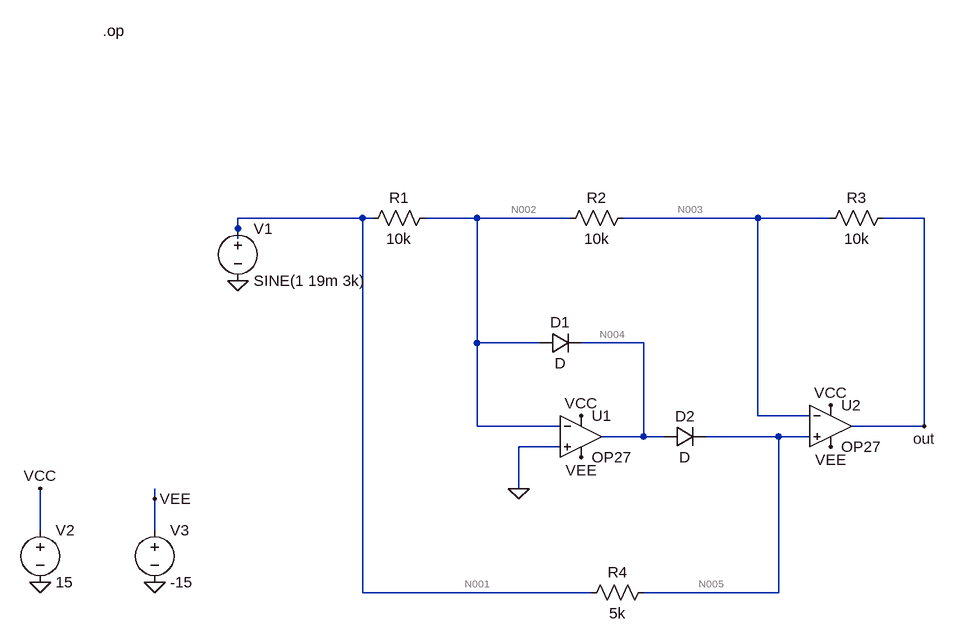
[diagram p0: schematic fullwaverect-DCOP.asc]
fullwaverect-DCOP.asc, the LTspice schematic file:
Version 4.1
SHEET 1 880 680
WIRE -128 -64 -320 -64
WIRE -112 -64 -128 -64
WIRE 48 -64 -32 -64
WIRE 192 -64 48 -64
WIRE 480 -64 272 -64
WIRE 592 -64 480 -64
WIRE 736 -64 672 -64
WIRE -320 -48 -320 -64
WIRE -320 -32 -320 -48
WIRE 48 128 48 -64
WIRE 144 128 48 128
WIRE 304 128 208 128
WIRE 480 240 480 -64
WIRE 560 240 480 240
WIRE 48 256 48 128
WIRE 176 256 48 256
WIRE 736 256 736 -64
WIRE 736 256 624 256
WIRE 304 272 304 128
WIRE 304 272 240 272
WIRE 336 272 304 272
WIRE 512 272 400 272
WIRE 560 272 512 272
WIRE 176 288 112 288
WIRE 112 352 112 288
WIRE -448 368 -448 352
WIRE -624 416 -624 352
WIRE -448 416 -448 368
WIRE -128 512 -128 -64
WIRE 224 512 -128 512
WIRE 512 512 512 272
WIRE 512 512 304 512
FLAG -320 32 0
FLAG -624 496 0
FLAG -448 496 0
FLAG -448 368 VEE
FLAG -624 352 VCC
FLAG 208 304 VEE
FLAG 208 240 VCC
FLAG 592 288 VEE
FLAG 592 224 VCC
FLAG 736 256 out
FLAG 112 352 0
SYMBOL diode 144 144 R270
WINDOW 0 32 32 VTop 2
WINDOW 3 0 32 VBottom 2
SYMATTR InstName D1
SYMBOL diode 336 288 R270
WINDOW 0 32 32 VTop 2
WINDOW 3 0 32 VBottom 2
SYMATTR InstName D2
SYMBOL OpAmps\\OP27 208 208 R0
SYMATTR InstName U1
SYMBOL OpAmps\\OP27 592 192 R0
SYMATTR InstName U2
SYMBOL res -16 -80 R90
WINDOW 0 0 56 VBottom 2
WINDOW 3 32 56 VTop 2
SYMATTR InstName R1
SYMATTR Value 10k
SYMBOL res 288 -80 R90
WINDOW 0 0 56 VBottom 2
WINDOW 3 32 56 VTop 2
SYMATTR InstName R2
SYMATTR Value 10k
SYMBOL res 688 -80 R90
WINDOW 0 0 56 VBottom 2
WINDOW 3 32 56 VTop 2
SYMATTR InstName R3
SYMATTR Value 10k
SYMBOL res 320 496 R90
WINDOW 0 0 56 VBottom 2
WINDOW 3 32 56 VTop 2
SYMATTR InstName R4
SYMATTR Value 5k
SYMBOL voltage -320 -64 R0
WINDOW 123 0 0 Left 0
WINDOW 39 0 0 Left 0
SYMATTR InstName V1
SYMATTR Value SINE(1 19m 3k)
SYMBOL voltage -624 400 R0
SYMATTR InstName V2
SYMATTR Value 15
SYMBOL voltage -448 400 R0
SYMATTR InstName V3
SYMATTR Value -15
TEXT -528 -352 Left 2 !.op

The netlist it stands for:
* fullwaverect-DCOP.asc
D1 N002 N004 D
D2 N004 N005 D
X§U1 0 N002 VCC VEE N004 OP27  ; pins In+ In- V+ V- OUT
X§U2 N005 N003 VCC VEE out OP27  ; pins In+ In- V+ V- OUT
R1 N002 N001 10k
R2 N003 N002 10k
R3 out N003 10k
R4 N005 N001 5k
V1 N001 0 SINE(1 19m 3k)
V2 VCC 0 15
V3 VEE 0 -15
.model D D
.lib standard.dio
.op
.lib ADI.lib
.backanno
.end

* Results of the author's LTspice run, read from the files saved beside the schematic
* Operating Point:
*   V(n004) = -613.5 mV
*   V(vcc) = 15 V
*   V(vee) = -15 V
*   V(out) = 2 V
*   V(n002) = 263.8 nV
*   V(n005) = 1 V
*   V(n003) = 1 V
*   V(n001) = 1 V
*   I(R4) = -168.4 pA
*   I(D1) = 200 µA
*   I(R1) = -100 µA
*   I(V2) = -5.894 mA
*   I(V3) = 5.994 mA
*   I(R2) = 100 µA
*   I(R3) = 100 µA
*   I(V1) = -100 µA
*   I(D2) = -1.623 pA
*   Ix(u2:1) = 166.8 pA
*   Ix(u2:2) = 166.5 pA
*   Ix(u2:3) = 3.023 mA
*   Ix(u2:4) = -2.923 mA
*   Ix(u2:5) = -100 µA
*   Ix(u1:1) = -43.97 fA
*   Ix(u1:2) = 44.02 fA
*   Ix(u1:3) = 2.871 mA
*   Ix(u1:4) = -3.071 mA
*   Ix(u1:5) = 200 µA